# Altium schematic sheet MCU.SchDoc
size A4
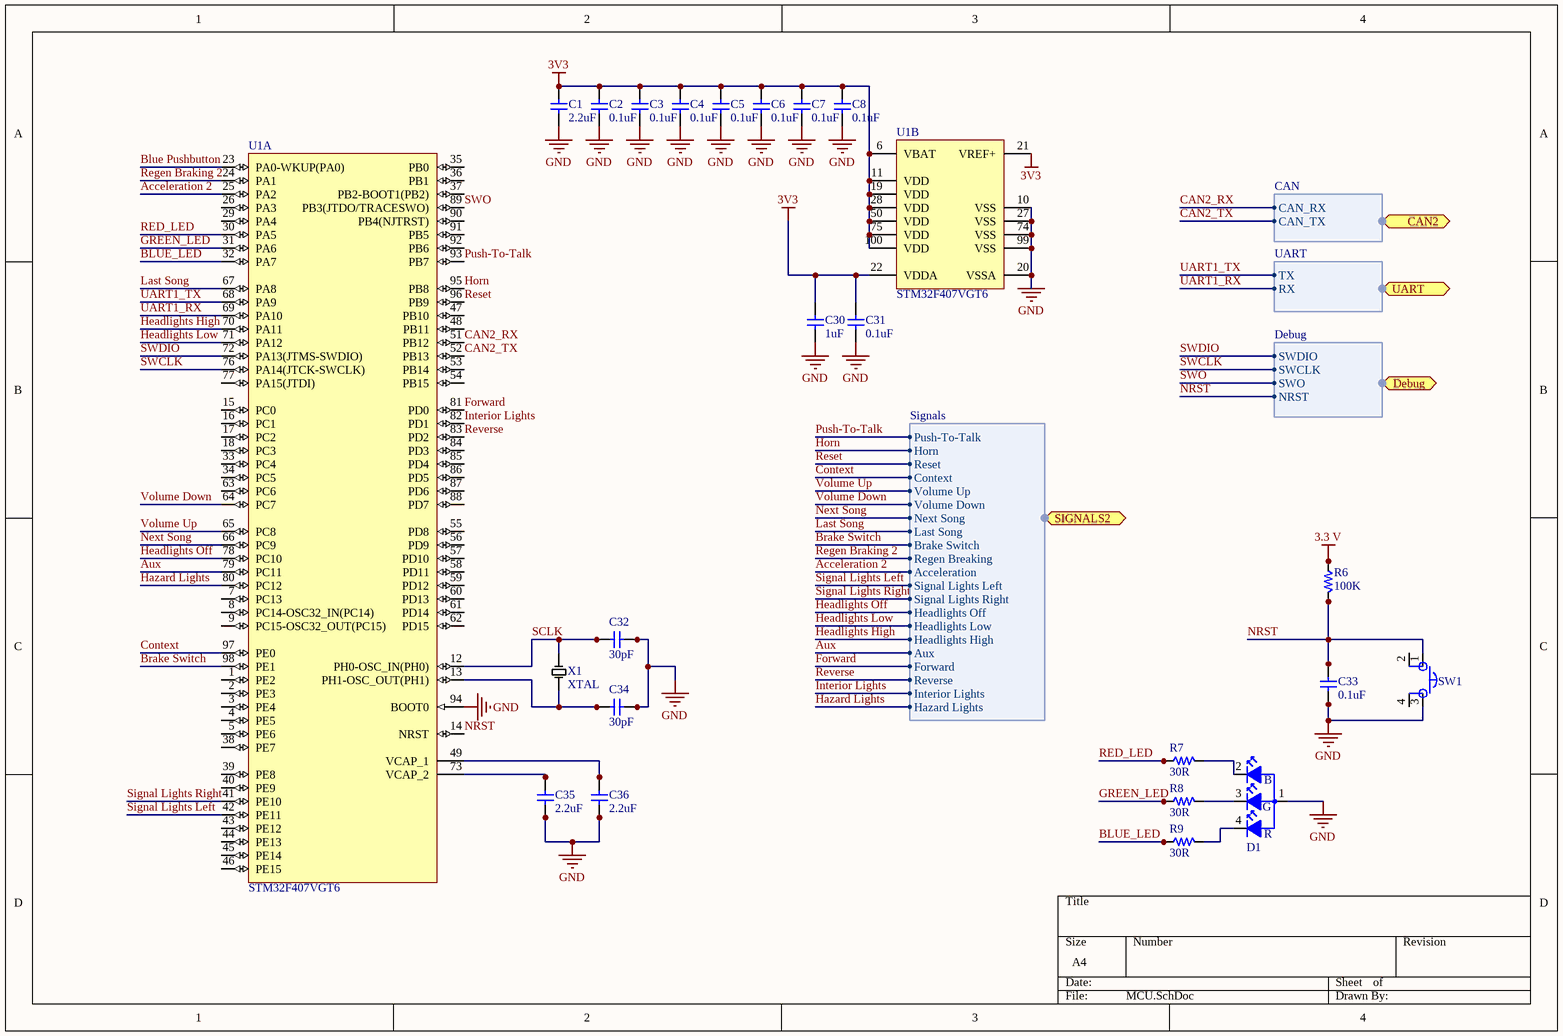
[diagram p0: MCU.SchDoc]

## Parts
C1  value 2.2uF  [PCB_GENERIC_SMD_0603]  (hidden comment: C060-002U2-00)
C2  value 0.1uF  [PCB_GENERIC_SMD_0603]  (hidden comment: C060-000U1-00)
C3  value 0.1uF  [PCB_GENERIC_SMD_0603]  (hidden comment: C060-000U1-00)
C4  value 0.1uF  [PCB_GENERIC_SMD_0603]  (hidden comment: C060-000U1-00)
C5  value 0.1uF  [PCB_GENERIC_SMD_0603]  (hidden comment: C060-000U1-00)
C6  value 0.1uF  [PCB_GENERIC_SMD_0603]  (hidden comment: C060-000U1-00)
C7  value 0.1uF  [PCB_GENERIC_SMD_0603]  (hidden comment: C060-000U1-00)
C8  value 0.1uF  [PCB_GENERIC_SMD_0603]  (hidden comment: C060-000U1-00)
C30  value 1uF  [PCB_GENERIC_SMD_0603]  (hidden comment: C060-0001U-00)
C31  value 0.1uF  [PCB_GENERIC_SMD_0603]  (hidden comment: C060-000U1-00)
C32  value 30pF  [PCB_GENERIC_SMD_0603]  (hidden comment: C060-0030P-00)
C33  value 0.1uF  [PCB_GENERIC_SMD_0603]  (hidden comment: C060-000U1-00)
C34  value 30pF  [PCB_GENERIC_SMD_0603]  (hidden comment: C060-0030P-00)
C35  value 2.2uF  [PCB_GENERIC_SMD_0603]  (hidden comment: C060-002U2-00)
C36  value 2.2uF  [PCB_GENERIC_SMD_0603]  (hidden comment: C060-002U2-00)
D1  D0S4-000CR-00  [CLMVB-FKA]  (value not drawn)
R6  value 100K  [PCB_GENERIC_SMD_0603]  (hidden comment: R060-00104-05)
R7  value 30R  [PCB_GENERIC_SMD_0603]  (hidden comment: R060-00300-05)
R8  value 30R  [PCB_GENERIC_SMD_0603]  (hidden comment: R060-00300-05)
R9  value 30R  [PCB_GENERIC_SMD_0603]  (hidden comment: R060-00300-05)
SW1  Tactile Switch  [C&K 4 pin Tactile Switch]  (value not drawn)
U1  STM32F407VGT6  [STM-LQFP100_M]  (parts A,B of 2)
X1  XTAL  [CRYSTAL_8MHZ]

## Ports
CAN2 (harness CAN), Debug (harness Debug), SIGNALS2 (harness Signals), UART (harness UART)

## Harnesses
Debug: SWDIO, SWCLK, SWO, NRST
CAN: CAN_RX, CAN_TX
UART: TX, RX
Signals: Push-To-Talk, Horn, Reset, Context, Volume Up, Volume Down, Next Song, Last Song, Brake Switch, Regen Breaking, Acceleration, Signal Lights Left, Signal Lights Right, Headlights Off, Headlights Low, Headlights High, Aux, Forward, Reverse, Interior Lights, Hazard Lights

## Nets
3.3 V: R6.1
3V3: C1.2 C2.2 C3.2 C4.2 C5.2 C6.2 C7.2 C8.2 C30.2 C31.2 U1.6(VBAT) U1.11(VDD) U1.19(VDD) U1.21(VREF+) U1.22(VDDA) U1.28(VDD) U1.50(VDD) U1.75(VDD) U1.100(VDD)
GND: C1.1 C2.1 C3.1 C4.1 C5.1 C6.1 C7.1 C8.1 C30.1 C31.1 C32.1 C33.2 C34.1 C35.1 C36.1 D1.1(Red) SW1.3 U1.10(VSS) U1.20(VSSA) U1.27(VSS) U1.74(VSS) U1.94(BOOT0) U1.99(VSS)
Acceleration 2: U1.25(PA2) ; port SIGNALS2.Acceleration
Aux: U1.79(PC11) ; port SIGNALS2.Aux
Blue Pushbutton: U1.23(PA0-WKUP(PA0))
BLUE_LED: R9.1 U1.32(PA7)
Brake Switch: U1.98(PE1) ; port SIGNALS2.Brake Switch
CAN2_RX: U1.51(PB12) ; port CAN2.CAN_RX
CAN2_TX: U1.52(PB13) ; port CAN2.CAN_TX
Context: U1.97(PE0) ; port SIGNALS2.Context
Forward: U1.81(PD0) ; port SIGNALS2.Forward
GREEN_LED: R8.1 U1.31(PA6)
Hazard Lights: U1.80(PC12) ; port SIGNALS2.Hazard Lights
Headlights High: U1.70(PA11) ; port SIGNALS2.Headlights High
Headlights Low: U1.71(PA12) ; port SIGNALS2.Headlights Low
Headlights Off: U1.78(PC10) ; port SIGNALS2.Headlights Off
Horn: U1.95(PB8) ; port SIGNALS2.Horn
Interior Lights: U1.82(PD1) ; port SIGNALS2.Interior Lights
Last Song: U1.67(PA8) ; port SIGNALS2.Last Song
Next Song: U1.66(PC9) ; port SIGNALS2.Next Song
NRST: C33.1 R6.2 SW1.1 U1.14(NRST) ; port Debug.NRST
Push-To-Talk: U1.93(PB7) ; port SIGNALS2.Push-To-Talk
RED_LED: R7.1 U1.30(PA5)
Regen Braking 2: U1.24(PA1) ; port SIGNALS2.Regen Breaking
Reset: U1.96(PB9) ; port SIGNALS2.Reset
Reverse: U1.83(PD2) ; port SIGNALS2.Reverse
SCLK: C32.2 U1.12(PH0-OSC_IN(PH0)) X1.1
Signal Lights Left: U1.42(PE11) ; port SIGNALS2.Signal Lights Left
Signal Lights Right: U1.41(PE10) ; port SIGNALS2.Signal Lights Right
SWCLK: U1.76(PA14(JTCK-SWCLK)) ; port Debug.SWCLK
SWDIO: U1.72(PA13(JTMS-SWDIO)) ; port Debug.SWDIO
SWO: U1.89(PB3(JTDO/TRACESWO)) ; port Debug.SWO
UART1_RX: U1.69(PA10) ; port UART.RX
UART1_TX: U1.68(PA9) ; port UART.TX
Volume Down: U1.64(PC7) ; port SIGNALS2.Volume Down
Volume Up: U1.65(PC8) ; port SIGNALS2.Volume Up
NetC34_2: C34.2 U1.13(PH1-OSC_OUT(PH1)) X1.2
NetC35_2: C35.2 U1.73(VCAP_2)
NetC36_2: C36.2 U1.49(VCAP_1)
NetD1_2: D1.2(Green) R7.2
NetD1_3: D1.3(Blue) R8.2
NetD1_4: D1.4 R9.2

Not connected (* = marked no-connect by the designer): SW1 2 4; U1 1(PE2) 2(PE3) 3(PE4) 4(PE5) 5(PE6) 7(PC13) 8(PC14-OSC32_IN(PC14)) 9(PC15-OSC32_OUT(PC15)) 15(PC0) 16(PC1) 17(PC2) 18(PC3) 26(PA3) 29(PA4) 33(PC4) 34(PC5) 35(PB0) 36(PB1) 37(PB2-BOOT1(PB2)) 38(PE7) 39(PE8) 40(PE9) 43(PE12) 44(PE13) 45(PE14) 46(PE15) 47(PB10) 48(PB11) 53(PB14) 54(PB15) 55(PD8) 56(PD9) 57(PD10) 58(PD11) 59(PD12) 60(PD13) 61(PD14) 62(PD15) 63(PC6) 77(PA15(JTDI)) 84(PD3) 85(PD4) 86(PD5) 87(PD6) 88(PD7) 90(PB4(NJTRST)) 91(PB5) 92(PB6)

## Notes on the sheet
- (in symbol D0S4-000CR-00) B; G; R

## Library data of the parts
C1 C35 C36 = C060-002U2-00: CAP CER 0603 2.2uF 16V X5R 20%; Tolerance: 20%; Voltage: 16V; Package: 0603
C2-C8 C31 C33 = C060-000U1-00: CAP CER 0603 0.1uF 16V X5R 20%; Tolerance: 20%; Voltage: 16V; Package: 0603
C30 = C060-0001U-00: CAP CER 0603 1uF 16V X5R 20%; Tolerance: 20%; Voltage: 16V; Package: 0603
C32 C34 = C060-0030P-00: CAP CER 0603 30pF 50V NP0 5%; Tolerance: 5%; Voltage: 50V; Package: 0603
D1 = D0S4-000CR-00: LED 4SMD RGB 2Vf 3Vf 3Vf 20mA 10mA 10mA; Supplier 1: Digi-Key; Supplier Part Number 1: CLMVB-FKA-CFHEHLCBB7A363CT-ND; Color: RGB
R6 = R060-00104-05: RES 0603 100K 5% 63mW; Tolerance: 5%; Power: 63mW; Package: 0603
R7-R9 = R060-00300-05: RES 0603 30ohm 5% 100mW; Tolerance: 5%; Power: 100mW; Package: 0603
SW1 = C&K Tactile Switch: Supplier 1: Digi-Key; Supplier Part Number 1: CKN9085CT-ND
U1 = STM32F407VGT6: ARM Cortex-M4 32-bit MCU+FPU, 210 DMIPS, 1024 kB Flash, 192 kB Internal RAM, 82 I/Os, 100-pin LQFP, -40 to 85 degC, Tray; Manufacturer: STMicroelectronics; D/A Converter: 2x12-bit; FLASH Size (Prog) (kB): 1024; I/Os (High Current): 82; Internal RAM Size (kB): 192; Operating Frequency(F) (Processor speed) (MHz): 168; Supply Voltage(Vcc) max (V): 3.6; Supply Voltage(Vcc) min (V): 1.8; DatasheetVersion: Rev. 4; PackageVersion: Rev. 1, 06/2013; PackageReference: LQFP100; PackageDescription: 100-Pin Low Profile Quad Flat Package, 14 x 14 mm Body, 0.5 mm Pitch; Supplier 1: Digi-Key; Supplier Part Number 1: 497-11605-ND; Supplier 2: Farnell; Supplier Part Number 2: 2064368; Supplier 3: Newark; Supplier Part Number 3: 73T2333; Supplier 4: Mouser; Supplier Part Number 4: 511-STM32F407VGT6; Core: ARM Cortex-M4; Packing: Tray; Mounting Technology: Surface Mount; PartNumber: STM32F407VGT6; ComponentLink1Description: Manufacturer URL; ComponentLink1URL: http://www.st.com/web/en/home.html; ComponentLink2Description: Datasheet; ComponentLink2URL: http://www.st.com/st-web-ui/static/active/en/resource/technical/document/datasheet/DM00037051.pdf; ComponentLink3Description: Package Specification; ComponentLink3URL: http://www.st.com/st-web-ui/static/active/en/resource/technical/document/data_brief/DM00071938.pdf
X1 = Crystal: Frequency: 8MHz